# Altium schematic sheet mcu.SchDoc
size A4
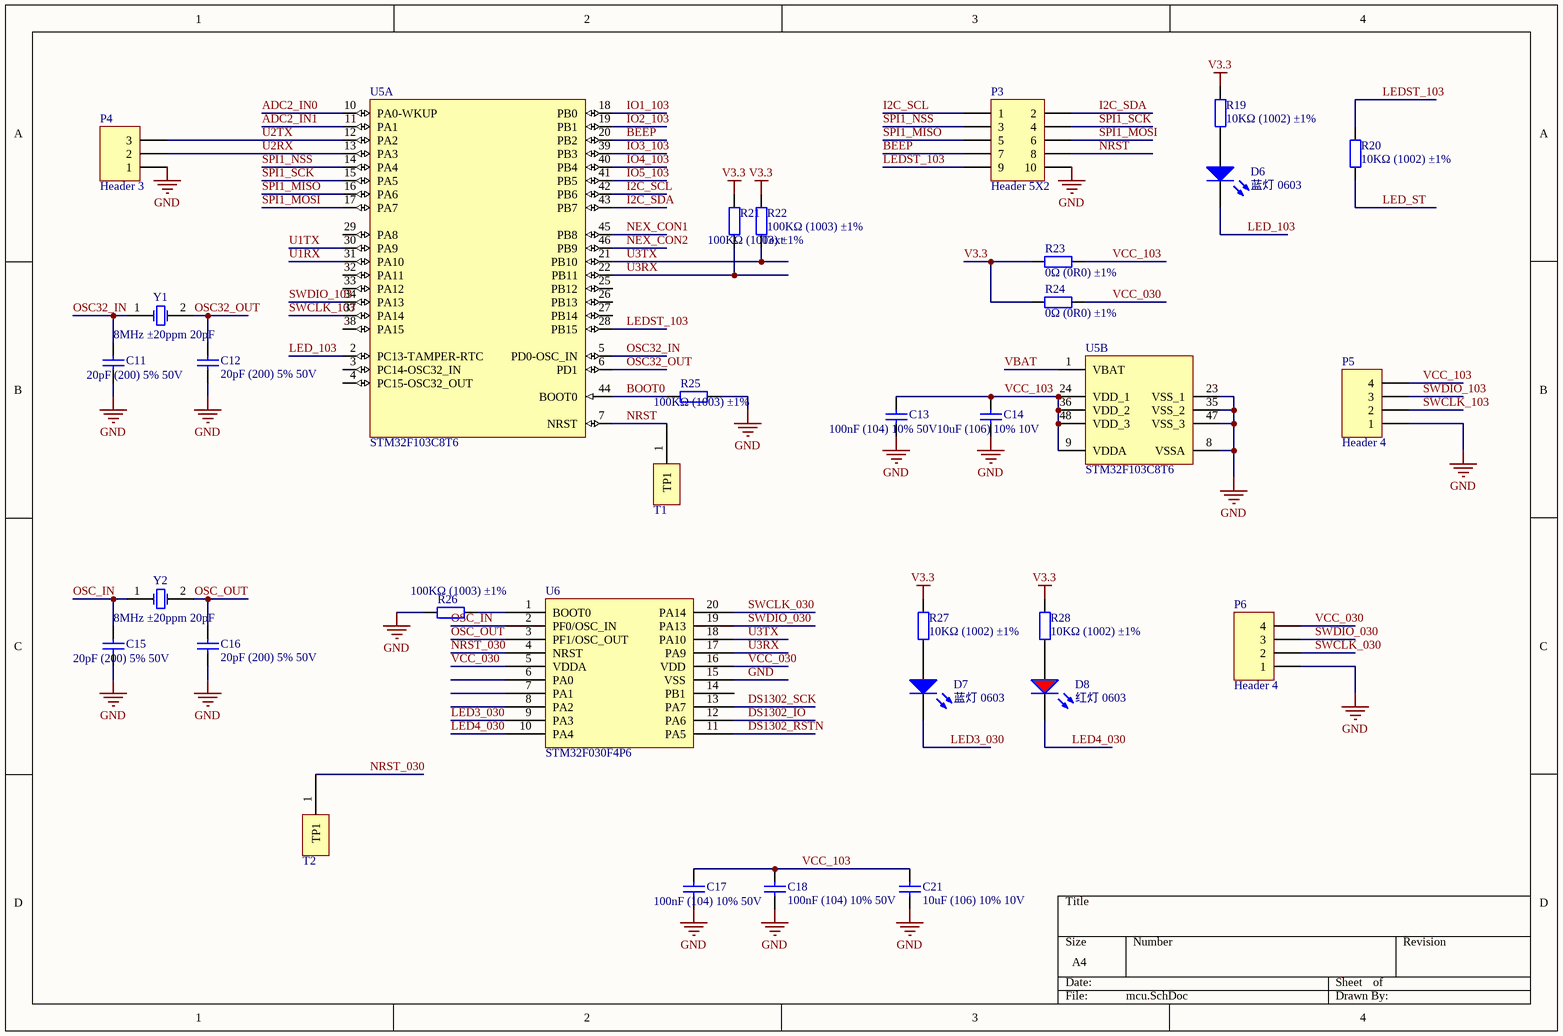
[diagram p0: mcu.SchDoc]

## Parts
C11  20pF (200) 5% 50V  [0603_C]
C12  20pF (200) 5% 50V  [0603_C]
C13  100nF (104) 10% 50V  [0603_C]
C14  10uF (106) 10% 10V  [0603_C]
C15  20pF (200) 5% 50V  [0603_C]
C16  20pF (200) 5% 50V  [0603_C]
C17  100nF (104) 10% 50V  [1206_C]
C18  100nF (104) 10% 50V  [1206_C]
C21  10uF (106) 10% 10V  [0603_C]
D6  蓝灯 0603  [0603_LED_S1]
D7  蓝灯 0603  [0603_LED_S1]
D8  红灯 0603  [0603_LED_S1]
P3  Header 5X2  [HDR2X5]
P4  Header 3  [HDR1X3]
P5  Header 4  [HDR1X4]
P6  Header 4  [HDR1X4]
R19  10KΩ (1002) ±1%  [0603_R]
R20  10KΩ (1002) ±1%  [0603_R]
R21  100KΩ (1003) ±1%  [0603_R]
R22  100KΩ (1003) ±1%  [0603_R]
R23  0Ω (0R0) ±1%  [1206_R]
R24  0Ω (0R0) ±1%  [1206_R]
R25  100KΩ (1003) ±1%  [0603_R]
R26  100KΩ (1003) ±1%  [0603_R]
R27  10KΩ (1002) ±1%  [0603_R]
R28  10KΩ (1002) ±1%  [0603_R]
T1  TP1  [TP1]  (value not drawn)
T2  TP1  [TP1]  (value not drawn)
U5  STM32F103C8T6  [LQFP-48_7x7x05P]  (parts A,B of 2)
U6  STM32F030F4P6  [TSSOP-20]
Y1  8MHz ±20ppm 20pF  [SMD-5032_2P]
Y2  8MHz ±20ppm 20pF  [SMD-5032_2P]

## Nets
GND: C11.1 C12.1 C13.1 C14.2 C15.1 C16.1 C17.1 C18.1 C21.2 P3.10 P4.1 P5.1 P6.1 R25.2 R26.1 U5.8(VSSA) U5.23(VSS_1) U5.35(VSS_2) U5.47(VSS_3) U6.15(VSS)
V3.3: R19.2 R21.2 R22.2 R23.1 R24.1 R27.2 R28.2
ADC2_IN0: U5.10(PA0-WKUP)
ADC2_IN1: U5.11(PA1)
BEEP: P3.7 U5.20(PB2)
BOOT0: R25.1 U5.44(BOOT0)
DS1302_IO: U6.12(PA6)
DS1302_RSTN: U6.11(PA5)
DS1302_SCK: U6.13(PA7)
I2C_SCL: P3.1 U5.42(PB6)
I2C_SDA: P3.2 U5.43(PB7)
IO1_103: U5.18(PB0)
IO2_103: U5.19(PB1)
IO3_103: U5.39(PB3)
IO4_103: U5.40(PB4)
IO5_103: U5.41(PB5)
LED3_030: D7.K U6.9(PA3)
LED4_030: D8.K U6.10(PA4)
LED_103: D6.K U5.2(PC13-TAMPER-RTC)
LED_ST: R20.1
LEDST_103: P3.9 R20.2 U5.28(PB15)
NEX_CON1: U5.45(PB8)
NEX_CON2: U5.46(PB9)
NRST: P3.8 T1.1(TP1) U5.7(NRST)
NRST_030: T2.1(TP1) U6.4(NRST)
OSC32_IN: C11.2 U5.5(PD0-OSC_IN) Y1.1(OSC1)
OSC32_OUT: C12.2 U5.6(PD1) Y1.2(OSC2)
OSC_IN: C15.2 U6.2(PF0/OSC_IN) Y2.1(OSC1)
OSC_OUT: C16.2 U6.3(PF1/OSC_OUT) Y2.2(OSC2)
SPI1_MISO: P3.5 U5.16(PA6)
SPI1_MOSI: P3.6 U5.17(PA7)
SPI1_NSS: P3.3 U5.14(PA4)
SPI1_SCK: P3.4 U5.15(PA5)
SWCLK_030: P6.2 U6.20(PA14)
SWCLK_103: P5.2 U5.37(PA14)
SWDIO_030: P6.3 U6.19(PA13)
SWDIO_103: P5.3 U5.34(PA13)
U1RX: U5.31(PA10)
U1TX: U5.30(PA9)
U2RX: P4.2 U5.13(PA3)
U2TX: P4.3 U5.12(PA2)
U3RX: R21.1 U5.22(PB11) U6.17(PA9)
U3TX: R22.1 U5.21(PB10) U6.18(PA10)
VBAT: U5.1(VBAT)
VCC_030: P6.4 R24.2 U6.5(VDDA) U6.16(VDD)
VCC_103: C13.2 C14.1 C17.2 C18.2 C21.1 P5.4 R23.2 U5.9(VDDA) U5.24(VDD_1) U5.36(VDD_2) U5.48(VDD_3)
NetD6_A: D6.A R19.1
NetD7_A: D7.A R27.1
NetD8_A: D8.A R28.1
NetR26_2: R26.2 U6.1(BOOT0)

Not connected (* = marked no-connect by the designer): U5 3(PC14-OSC32_IN) 4(PC15-OSC32_OUT) 25(PB12) 26(PB13) 27(PB14) 29(PA8) 32(PA11) 33(PA12) 38(PA15); U6 6(PA0) 7(PA1) 8(PA2) 14(PB1)

## Notes on the sheet
- (near R22) Text

## Library data of the parts
C11 C12 C15 C16 = 0603 20pF (200) 5% 50V: 贴片电容; ComponentLink1Description: 供应商链接; ComponentLink1URL: http://www.szlcsc.com/product/details_2000.html; Package: 0603; Supplier: LC; SuppliersPartNumber: C1648
C13 = 0603 100nF (104) 10% 50V: 贴片电容; ComponentLink1Description: 供应商链接; ComponentLink1URL: http://www.szlcsc.com/product/details_15331.html; Package: 0603; Supplier: LC; SuppliersPartNumber: C14663
C14 C21 = 0603 10uF (106) 10% 10V: 贴片电容; ComponentLink1Description: 供应商链接; ComponentLink1URL: http://www.szlcsc.com/product/details_20411.html; Package: 0603; Supplier: LC; SuppliersPartNumber: C19702
C17 C18 = 1206 100nF (104) 10% 50V: 贴片电容; ComponentLink1Description: 供应商链接; ComponentLink1URL: http://www.szlcsc.com/product/details_25237.html; Package: 1206; Supplier: LC; SuppliersPartNumber: C24497
D6 D7 = 0603 蓝灯: 发光二极管; ComponentLink1Description: 供应商链接; ComponentLink1URL: http://www.szlcsc.com/product/details_73150.html; Package: 0603; Supplier: LC; SuppliersPartNumber: C72041
D8 = 0603 红灯: 发光二极管; ComponentLink1Description: 供应商链接; ComponentLink1URL: http://www.szlcsc.com/product/details_2659.html; Package: 0603; Supplier: LC; SuppliersPartNumber: C2286
P3 = Header 5X2: Header, 5-Pin, Dual row; LatestRevisionDate: 17-Jul-2002; LatestRevisionNote: Re-released for DXP Platform.; Publisher: Altium Limited
P4 = Header 3: Header, 3-Pin; LatestRevisionDate: 17-Jul-2002; LatestRevisionNote: Re-released for DXP Platform.; Publisher: Altium Limited
P5 P6 = Header 4: Header, 4-Pin; LatestRevisionDate: 17-Jul-2002; LatestRevisionNote: Re-released for DXP Platform.; Publisher: Altium Limited
R19 R20 R27 R28 = 0603 10KΩ (1002) 1%: 贴片电阻; ComponentLink1Description: 供应商链接; ComponentLink1URL: http://www.szlcsc.com/product/details_26547.html; Package: 0603; Supplier: LC; SuppliersPartNumber: C25804
R21 R22 R25 R26 = 0603 100KΩ (1003) 1%: 贴片电阻; ComponentLink1Description: 供应商链接; ComponentLink1URL: http://www.szlcsc.com/product/details_26546.html; Package: 0603; Supplier: LC; SuppliersPartNumber: C25803
R23 R24 = 1206 0Ω (0R0) 1%: 贴片电阻; ComponentLink1Description: 供应商链接; ComponentLink1URL: http://www.szlcsc.com/product/details_18576.html; Package: 1206; Supplier: LC; SuppliersPartNumber: C17888
U5 = STM32F103C8T6: ARM; ComponentLink1Description: 供应商链接; ComponentLink1URL: http://www.szlcsc.com/product/details_9243.html; Package: LQFP-48_7x7x05P; Supplier: LC; SuppliersPartNumber: C8734
U6 = STM32F030F4P6: ARM; ComponentLink1Description: 供应商链接; ComponentLink1URL: http://www.szlcsc.com/product/details_33873.html; Package: TSSOP-20; Supplier: LC; SuppliersPartNumber: C32908
Y1 Y2 = SMD-5032_2P 8MHz 20ppm 20pF: 贴片晶振; ComponentLink1Description: 供应商链接; ComponentLink1URL: http://www.szlcsc.com/product/details_117214.html; Package: SMD-5032_2P; Supplier: LC; SuppliersPartNumber: C115962